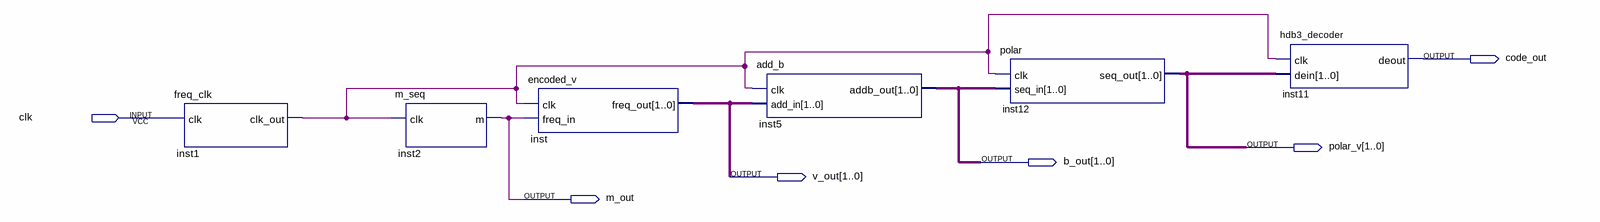
[diagram p0: schematic sheet]
// Quartus schematic HDB3.bdf as structural Verilog: 6 symbols, 6 pins
module HDB3 (
  input  clk,
  output code_out,
  output [1:0] polar_v,
  output [1:0] b_out,
  output [1:0] v_out,
  output m_out
);

  wire inst1_clk_out;

  freq_clk inst1 (.clk(clk), .clk_out(inst1_clk_out));
  m_seq inst2 (.clk(inst1_clk_out), .m(m_out));
  encoded_v inst (.clk(inst1_clk_out), .freq_in(m_out), .freq_out(v_out));
  add_b inst5 (.clk(inst1_clk_out), .add_in(v_out), .addb_out(b_out));
  polar inst12 (.clk(inst1_clk_out), .seq_in(b_out), .seq_out(polar_v));
  hdb3_decoder inst11 (.clk(inst1_clk_out), .dein(polar_v), .deout(code_out));
endmodule
